# EAGLE schematic schemaTelemetre (EAGLE 7.5.0)
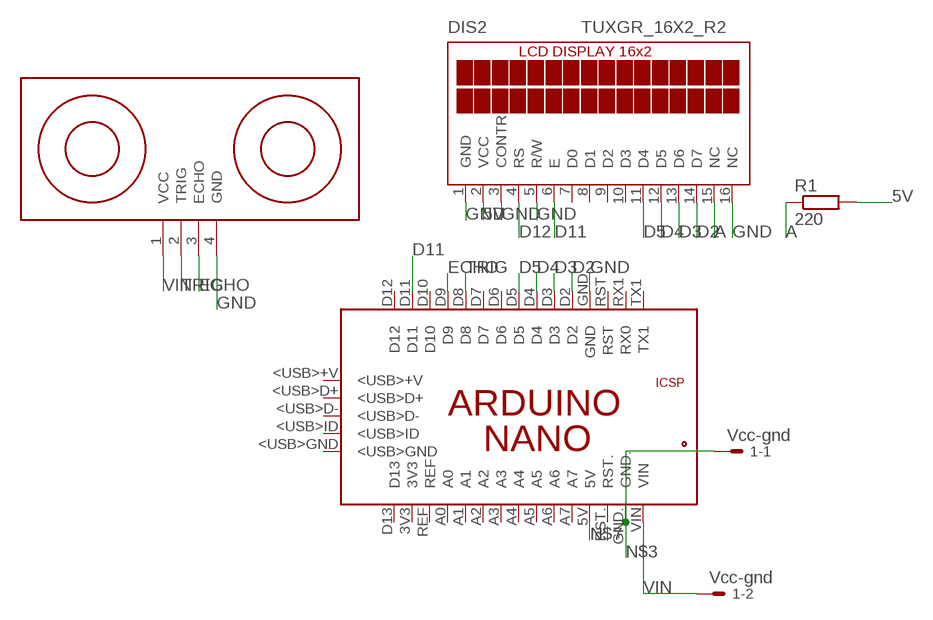
[diagram p0: schematic, sheet 1]

## Parts
1  Vcc-gnd  332-02  [332-02]
DIS2  TUXGR_16X2_R2  [TUXGR_16X2_R2]
PCB1  ARDUINO_NANO  [ARDUINO_NANO]
R1  220  R-EU_0204/7  [0204/7]
U$1  ULTRASONIC-HC-SR04#V  [ULTRASONIC-HC-SR04#V]

## Nets
5V: DIS2.2(VCC) R1.2
A: DIS2.15(NC) R1.1
D2: DIS2.14(D7) PCB1.D2
D3: DIS2.13(D6) PCB1.D3
D4: DIS2.12(D5) PCB1.D4
D5: DIS2.11(D4) PCB1.D5
D11: DIS2.6(E) PCB1.D11
D12: DIS2.4(RS)
ECHO: PCB1.D9 U$1.3(ECHO)
GND: DIS2.1(GND) DIS2.3(CONTR) DIS2.5(R/W) DIS2.16(NC) PCB1.GND U$1.4(GND)
N$3: 1.1 PCB1.GND.
N$7: PCB1.5V
TRIG: PCB1.D8 U$1.2(TRIG)
VIN: 1.2 PCB1.VIN U$1.1(VCC)
Unconnected: DIS2.7(D0) DIS2.8(D1) DIS2.9(D2) DIS2.10(D3) PCB1.3V3 PCB1.5V. PCB1.<USB>+V PCB1.<USB>D+ PCB1.<USB>D- PCB1.<USB>GND PCB1.<USB>ID PCB1.A0 PCB1.A1 PCB1.A2 PCB1.A3 PCB1.A4 PCB1.A5 PCB1.A6 PCB1.A7 PCB1.D6 PCB1.D7 PCB1.D10 PCB1.D12 PCB1.D13 PCB1.GND_ PCB1.MISO PCB1.MOSI PCB1.REF PCB1.RESET.. PCB1.RST PCB1.RST. PCB1.RX1(RX0) PCB1.SCK PCB1.TX1

## Library data of the parts
1 = con-garry:332-02: 2 Pin - 2mm Dual Row Source: www.mpe-connector.de / garry_shortform_2012.pdf
DIS2 = display-lcd:TUXGR_16X2_R2: Tuxgraphics LCD display 16x2 characters reflective, without background light Source: tuxgr_12x2_r2.pdf; OC_FARNELL: unknown; OC_NEWARK: unknown
PCB1 = E14_Arduino_revB:ARDUINO_NANO: Device for representing an Arduino Nano board with a footprint in an EAGLE design. Created by Dave Young for Element14. More EAGLE documentation at: http://www.element14.com/community/community/knode/cadsoft_eagle
R1 = resistor:R-EU_: RESISTOR, European symbol
U$1 = diy-modules:ULTRASONIC-HC-SR04: Ultrasonic Ranging Module HC-SR04

## Net classes
0 default: width 0.4 mm, drill 0.6 mm, clearance 0.3 mm